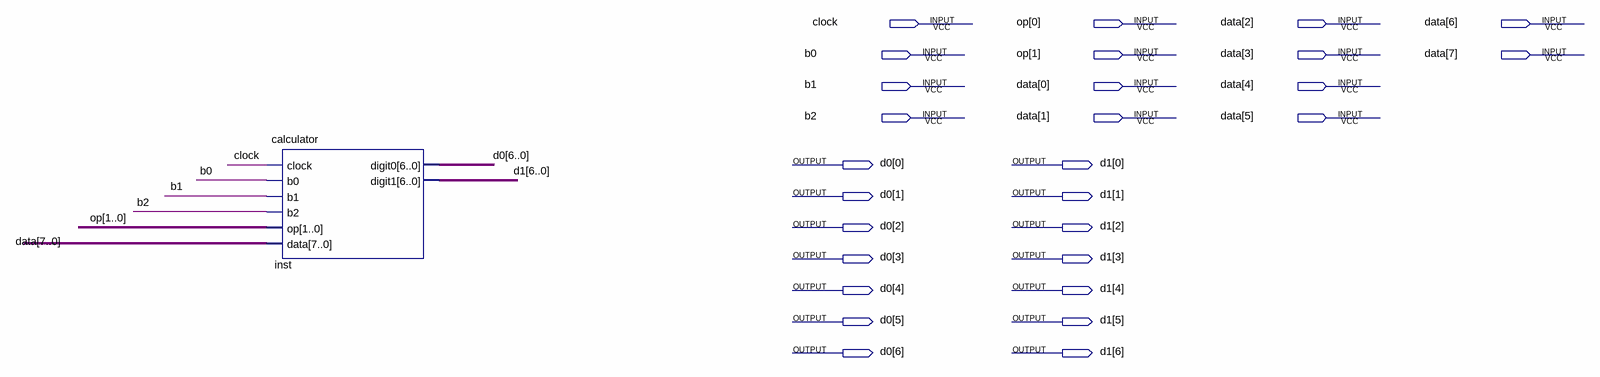
[diagram p0: schematic sheet]
// Quartus schematic calcview.bdf as structural Verilog: 1 symbols, 28 pins
module calcview (
  input  clock,
  input  [1:0] op,
  input  [7:0] data,
  input  b0,
  input  b1,
  input  b2,
  output [6:0] d0,
  output [6:0] d1
);

  calculator inst (.clock(clock), .b0(b0), .b1(b1), .b2(b2), .op(op), .data(data), .digit0(d0), .digit1(d1));
endmodule
